# EAGLE design Sensor_Python (EAGLE 9.6.2)
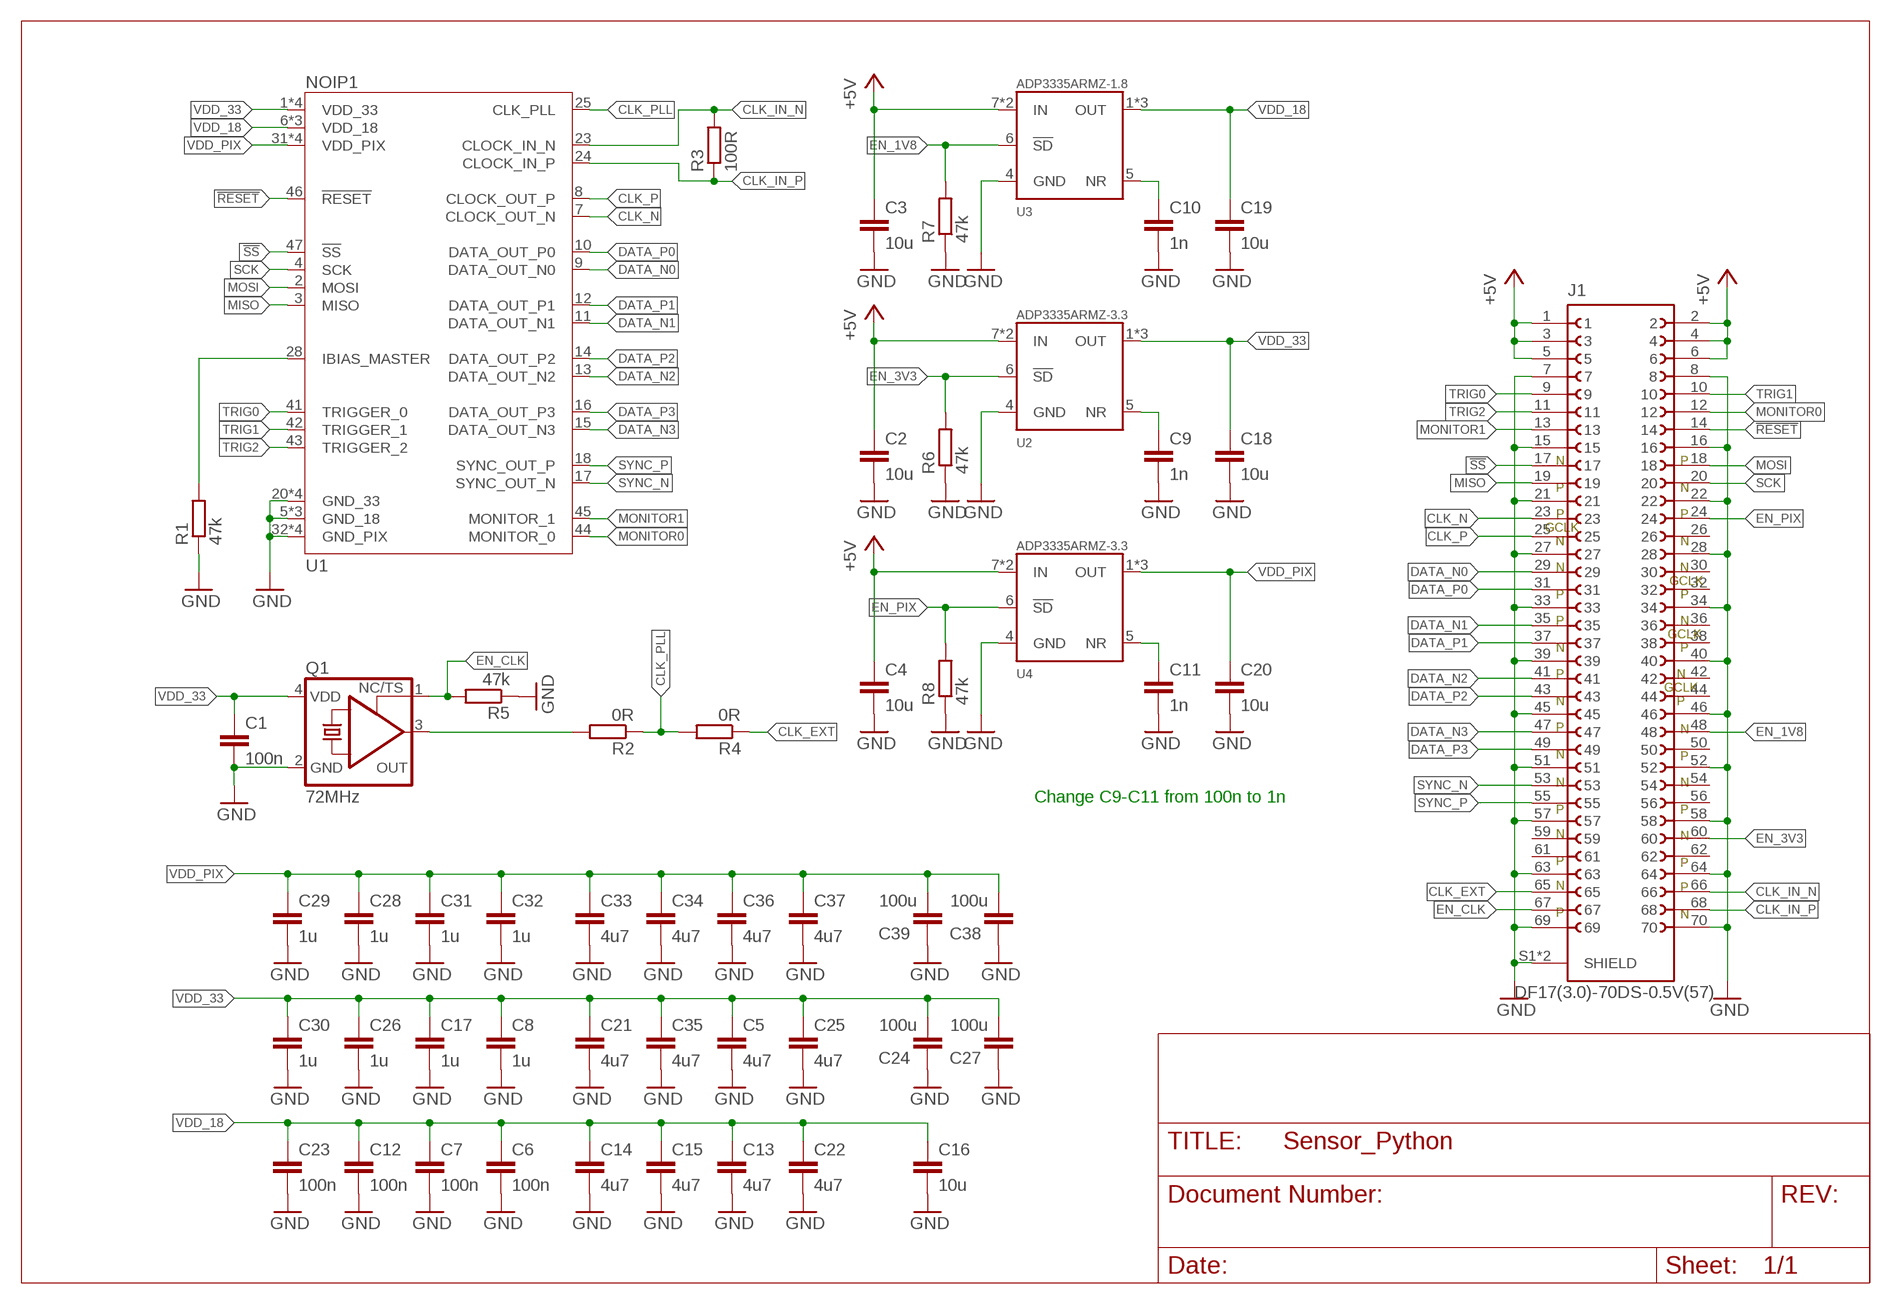
[diagram p0: schematic, sheet 1]

## Parts
C1  100n  C-EUC0402  [C0402]
C2  10u  C-EUC0603  [C0603]
C3  10u  C-EUC0603  [C0603]
C4  10u  C-EUC0603  [C0603]
C5  4u7  C-EUC0603  [C0603]
C6  100n  C-EUC0402  [C0402]
C7  100n  C-EUC0402  [C0402]
C8  1u  C-EUC0402  [C0402]
C9  1n  C-EUC0402  [C0402]
C10  1n  C-EUC0402  [C0402]
C11  1n  C-EUC0402  [C0402]
C12  100n  C-EUC0402  [C0402]
C13  4u7  C-EUC0603  [C0603]
C14  4u7  C-EUC0603  [C0603]
C15  4u7  C-EUC0603  [C0603]
C16  10u  C-EUC0603  [C0603]
C17  1u  C-EUC0402  [C0402]
C18  10u  C-EUC0603  [C0603]
C19  10u  C-EUC0603  [C0603]
C20  10u  C-EUC0603  [C0603]
C21  4u7  C-EUC0603  [C0603]
C22  4u7  C-EUC0603  [C0603]
C23  100n  C-EUC0402  [C0402]
C24  100u  C-EUC1206  [C1206]
C25  4u7  C-EUC0603  [C0603]
C26  1u  C-EUC0402  [C0402]
C27  100u  C-EUC1206  [C1206]
C28  1u  C-EUC0402  [C0402]
C29  1u  C-EUC0402  [C0402]
C30  1u  C-EUC0402  [C0402]
C31  1u  C-EUC0402  [C0402]
C32  1u  C-EUC0402  [C0402]
C33  4u7  C-EUC0603  [C0603]
C34  4u7  C-EUC0603  [C0603]
C35  4u7  C-EUC0603  [C0603]
C36  4u7  C-EUC0603  [C0603]
C37  4u7  C-EUC0603  [C0603]
C38  100u  C-EUC1206  [C1206]
C39  100u  C-EUC1206  [C1206]
J1  DF17(3.0)-70DS-0.5V(57)  [DF17(3.0)-70DS-0.5V(57)]
Q1  72MHz  KXO-PXO/XO-V96  [3.2X2.5_KXO-V96]
R1  47k  R-EU_R0402  [R0402]
R2  0R  R-EU_R0402  [R0402]
R3  100R  R-EU_R0402  [R0402]
R4  0R  R-EU_R0402  [R0402]
R5  47k  R-EU_R0402  [R0402]
R6  47k  R-EU_R0402  [R0402]
R7  47k  R-EU_R0402  [R0402]
R8  47k  R-EU_R0402  [R0402]
U1  NOIP1  [LCC-44]
U2  ADP3335ARMZ-3.3  ADP3335ARMZ  [MSOP08]
U3  ADP3335ARMZ-1.8  ADP3335ARMZ  [MSOP08]
U4  ADP3335ARMZ-3.3  ADP3335ARMZ  [MSOP08]

## Nets
!RESET: J1.14 U1.46(!RESET)
!SS: J1.17 U1.47(!SS)
+5V: C2.1 C3.1 C4.1 J1.1 J1.2 J1.3 J1.4 J1.5 J1.6 U2.7(IN) U2.8(IN) U3.7(IN) U3.8(IN) U4.7(IN) U4.8(IN)
CLK: Q1.3(OUT) R2.2
CLK_EXT: J1.65 R4.1
CLK_IN_N: J1.66 R3.2 U1.23(CLOCK_IN_N)
CLK_IN_P: J1.68 R3.1 U1.24(CLOCK_IN_P)
CLK_N: J1.23 U1.7(CLOCK_OUT_N)
CLK_P: J1.25 U1.8(CLOCK_OUT_P)
CLK_PLL: R2.1 R4.2 U1.25(CLK_PLL)
DATA_N0: J1.29 U1.9(DATA_OUT_N0)
DATA_N1: J1.35 U1.11(DATA_OUT_N1)
DATA_N2: J1.41 U1.13(DATA_OUT_N2)
DATA_N3: J1.47 U1.15(DATA_OUT_N3)
DATA_P0: J1.31 U1.10(DATA_OUT_P0)
DATA_P1: J1.37 U1.12(DATA_OUT_P1)
DATA_P2: J1.43 U1.14(DATA_OUT_P2)
DATA_P3: J1.49 U1.16(DATA_OUT_P3)
EN_1V8: J1.48 R7.2 U3.6(!SD)
EN_3V3: J1.60 R6.2 U2.6(!SD)
EN_CLK: J1.67 Q1.1(TS) R5.2
EN_PIX: J1.24 R8.2 U4.6(!SD)
GND: C1.2 C2.2 C3.2 C4.2 C5.2 C6.2 C7.2 C8.2 C9.2 C10.2 C11.2 C12.2 C13.2 C14.2 C15.2 C16.2 C17.2 C18.2 C19.2 C20.2 C21.2 C22.2 C23.2 C24.2 C25.2 C26.2 C27.2 C28.2 C29.2 C30.2 C31.2 C32.2 C33.2 C34.2 C35.2 C36.2 C37.2 C38.2 C39.2 J1.7 J1.8 J1.15 J1.16 J1.21 J1.22 J1.27 J1.28 J1.33 J1.34 J1.39 J1.40 J1.45 J1.46 J1.51 J1.52 J1.57 J1.58 J1.63 J1.64 J1.69 J1.70 J1.S1(SHIELD) J1.S2(SHIELD) Q1.2(GND) R1.1 R5.1 R6.1 R7.1 R8.1 U1.5(GND_18) U1.20(GND_33) U1.21(GND_18) U1.27(GND_18) U1.30(GND_33) U1.32(GND_PIX) U1.34(GND_PIX) U1.35(GND_33) U1.37(GND_PIX) U1.39(GND_PIX) U1.48(GND_33) U2.4(GND) U3.4(GND) U4.4(GND)
MISO: J1.19 U1.3(MISO)
MONITOR0: J1.12 U1.44(MONITOR_0)
MONITOR1: J1.13 U1.45(MONITOR_1)
MOSI: J1.18 U1.2(MOSI)
N$00001: R1.2 U1.28(IBIAS_MASTER)
N$00002: C11.1 U4.5(NR)
N$00003: C10.1 U3.5(NR)
N$00004: C9.1 U2.5(NR)
SCK: J1.20 U1.4(SCK)
SYNC_N: J1.53 U1.17(SYNC_OUT_N)
SYNC_P: J1.55 U1.18(SYNC_OUT_P)
TRIG0: J1.9 U1.41(TRIGGER_0)
TRIG1: J1.10 U1.42(TRIGGER_1)
TRIG2: J1.11 U1.43(TRIGGER_2)
VDD_18: C6.1 C7.1 C12.1 C13.1 C14.1 C15.1 C16.1 C19.1 C22.1 C23.1 U1.6(VDD_18) U1.22(VDD_18) U1.26(VDD_18) U3.1(OUT) U3.2(OUT) U3.3(OUT)
VDD_33: C1.1 C5.1 C8.1 C17.1 C18.1 C21.1 C24.1 C25.1 C26.1 C27.1 C30.1 C35.1 Q1.4(VDD) U1.1(VDD_33) U1.19(VDD_33) U1.29(VDD_33) U1.36(VDD_33) U2.1(OUT) U2.2(OUT) U2.3(OUT)
VDD_PIX: C20.1 C28.1 C29.1 C31.1 C32.1 C33.1 C34.1 C36.1 C37.1 C38.1 C39.1 U1.31(VDD_PIX) U1.33(VDD_PIX) U1.38(VDD_PIX) U1.40(VDD_PIX) U4.1(OUT) U4.2(OUT) U4.3(OUT)
Unconnected: J1.26 J1.30 J1.32 J1.36 J1.38 J1.42 J1.44 J1.50 J1.54 J1.56 J1.59 J1.61 J1.62

## Notes on the sheet
- N
   
  P
- P
   
  N
- P
   GCLK
  N
- P
   
  N
- N
   
  P
- N
   GCLK
  P
- P
   
  N
- N
  GCLK
  P
- P
  
  N
- N
  GCLK
  P
- P
   
  N
- N
   
  P
- N
   
  P
- N
   
  P
- Change C9-C11 from 100n to 1n
- N
   
  P
- N
   
  P
- N
   
  P
- P
   
  N

## Library data of the parts
C1 = rcl:C-EU: CAPACITOR, European symbol; LCSC: C1525
C2-C4 C8 C16-C20 C26 C28-C32 = rcl:C-EU: CAPACITOR, European symbol; SPICEPREFIX: C
C5 C13-C15 C21 C22 C25 C33-C37 = rcl:C-EU: CAPACITOR, European symbol; LCSC: C19666; SPICEPREFIX: C
C6 C7 C9-C12 C23 = rcl:C-EU: CAPACITOR, European symbol; LCSC: C1525; SPICEPREFIX: C
C24 C27 C38 C39 = rcl:C-EU: CAPACITOR, European symbol; DIGIKEY: 490-GRM31CD80J107MEA8LCT-ND; LCSC: C15008; SPICEPREFIX: C
J1 = Hirose:DF17(3.0)-70DS-0.5V(57)
Q1 = crystal-geyer_V1_0:KXO-PXO/XO-V: Clock Oscillator (PXO/XO) MHz : KXO-V - Serie Model Size l/w/h [mm] Frequency Range Frequency Stability Temp. Range [°C] Output AECQ 200 availabel Datasheet KXO-V94 KXO-V94 KXO-V95 KXO-V95 KXO-V96 KXO-V96 KXO-V99 KXO-V99 KXO-97 KXO-V97 KXO-97 - KXO-V97 2.0/1.6/0.80 2.0/1.6/0.80 2.5/2.0/0.82 2.5/2.0/0.82 3.2/2.5/1.2 3.2/2.5/1.2 5.0/3.2/1.2 5.0/3.2/1.2 7.0/5.08/1.3 7.0/5.08/1.3 7.0/5.08/1.3 32,768 kHz 1,0 ~ 80,0 MHz 32,768 kHz 1,0 ~ 70,0 MHz 32,768 kHz 1,0 ~ 156,0 MHz 32,768 kHz 1,0 ~ 200,0 MHz 32,768 kHz 32,768 kHz 1,0 ~ 160,0 MHz ±25 … ±100ppm ±25 … ±100ppm ±25 … ±100ppm ±25 … ±100ppm ±25 … ±100ppm ±25 … ±100ppm ±25 … ±100ppm ±25 … ±100ppm ±25 … ±100ppm ±25 … ±100ppm ±25 … ±100ppm (*) -40°C …+85°C (*) -40°C …+85°C (*) -40°C …+85°C (*) -40°C …+85°C (*) -40°C …+85°C (*) -40°C …+85°C (*) -40°C …+85°C (*) -40°C …+85°C (*) -40°C …+85°C (*) -40°C …+85°C (*) -40°C …+85°C HCMOS HCMOS HCMOS HCMOS HCMOS HCMOS HCMOS HCMOS HCMOS HCMOS HCMOS - - yes yes yes yes - - - - - KXO-V94-kHz.pdf <http://www.geyer-electronic.de/uploads/tx_userartikelfrequenz/GEYER-KXO-V94-kHz.pdf> KXO-V94.pdf <http://www.geyer-electronic.de/uploads/tx_userartikelfrequenz/GEYER-KXO-V94.pdf> KXO-V95-kHz.pdf <http://www.geyer-electronic.de/uploads/tx_userartikelfrequenz/GEYER-KXO-V95-kHz.pdf> KXO-V95.pdf <http://www.geyer-electronic.de/uploads/tx_userartikelfrequenz/GEYER-KXO-V95.pdf> KXO-V96-kHz.pdf <http://www.geyer-electronic.de/uploads/tx_userartikelfrequenz/GEYER-KXO-V96-kHz.pdf> KXO-V96.pdf <http://www.geyer-electronic.de/uploads/tx_userartikelfrequenz/GEYER-KXO-V96.pdf> KXO-V99-kHz.pdf <http://www.geyer-electronic.de/uploads/tx_userartikelfrequenz/GEYER-KXO-V99-kHz.pdf> KXO-V99.pdf <http://www.geyer-electronic.de/uploads/tx_userartikelfrequenz/GEYER-KXO-V99.pdf> KXO-97-kHz.pdf <http://www.geyer-electronic.de/uploads/tx_userartikelfrequenz/GEYER-KXO-97-kHz.pdf> KXO-V97-kHz.pdf <http://www.geyer-electronic.de/uploads/tx_userartikelfrequenz/GEYER-KXO-V97-kHz.pdf> KXO-V97.pdf <http://www.geyer-electronic.de/uploads/tx_userartikelfrequenz/GEYER-KXO-V97.pdf> <http://www.geyer-electronic.de/fileadmin/template/img/logo-geyer-electronic.png> Details see: http://www.geyer-electronic.de/Frequenz-Produkte.9.0.html Created 2016-06-07, Hans Locher 2016 (C) Geyer Quartz Technology Hans Locher KXOV94,KXOV95;KXOV96;KXOV97;KXO97;2016;2520;3225;5032;70508;2,5x2,0;3,2x2,5;5,0x3,2;7,0x5,08;2.5x2.0;3.2x2.5;5.0x3.2;7.0x5.08;; DIGIKEY: 1473-SIT8208AC-23-33E-72.000000-ND
R1-R8 = rcl:R-EU_: RESISTOR, European symbol; SPICEPREFIX: R
U1 = onsemi:NOIP1: PYTHON 300 / 500 / 1300 1.3/0.5/0.3 MegaPixels Global Shutter CMOS Image Sensors NOIP1SN/SE/FN
U2 U4 = analog_devices:ADP3335: ADP3335 High Accuracy, Ultralow I Q , 500 mA, anyCAP Low Dropout Regulator; DIGIKEY: 505-ADP3335ARMZ-3.3RL7CT-ND
U3 = analog_devices:ADP3335: ADP3335 High Accuracy, Ultralow I Q , 500 mA, anyCAP Low Dropout Regulator; DIGIKEY: 505-ADP3335ARMZ-1.8-R7CT-ND

## Board
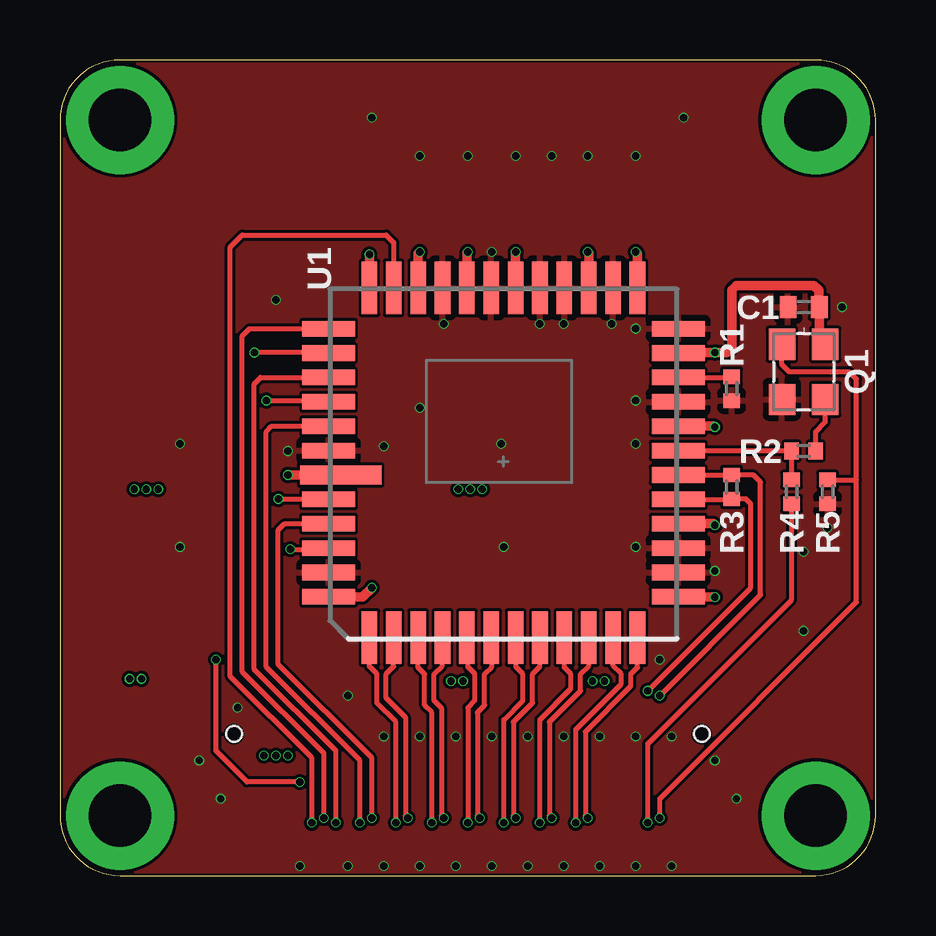
[diagram p1: board, top side]
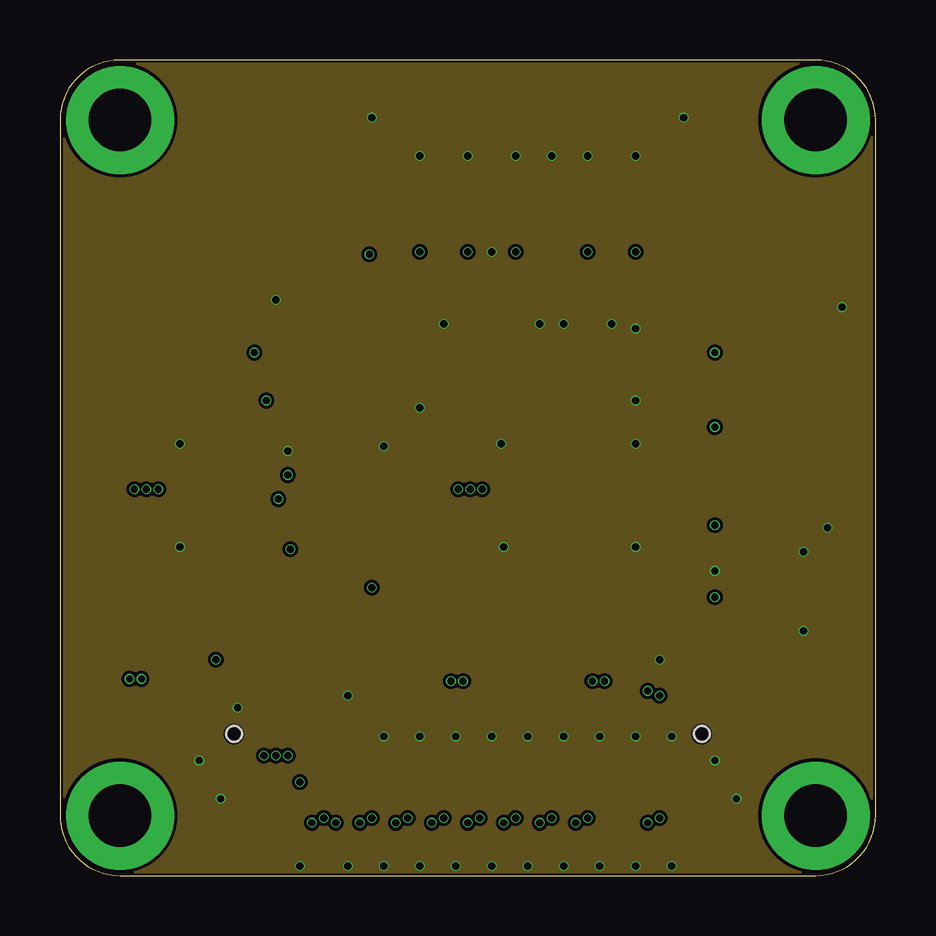
[diagram p2: board, inner layer Route2]
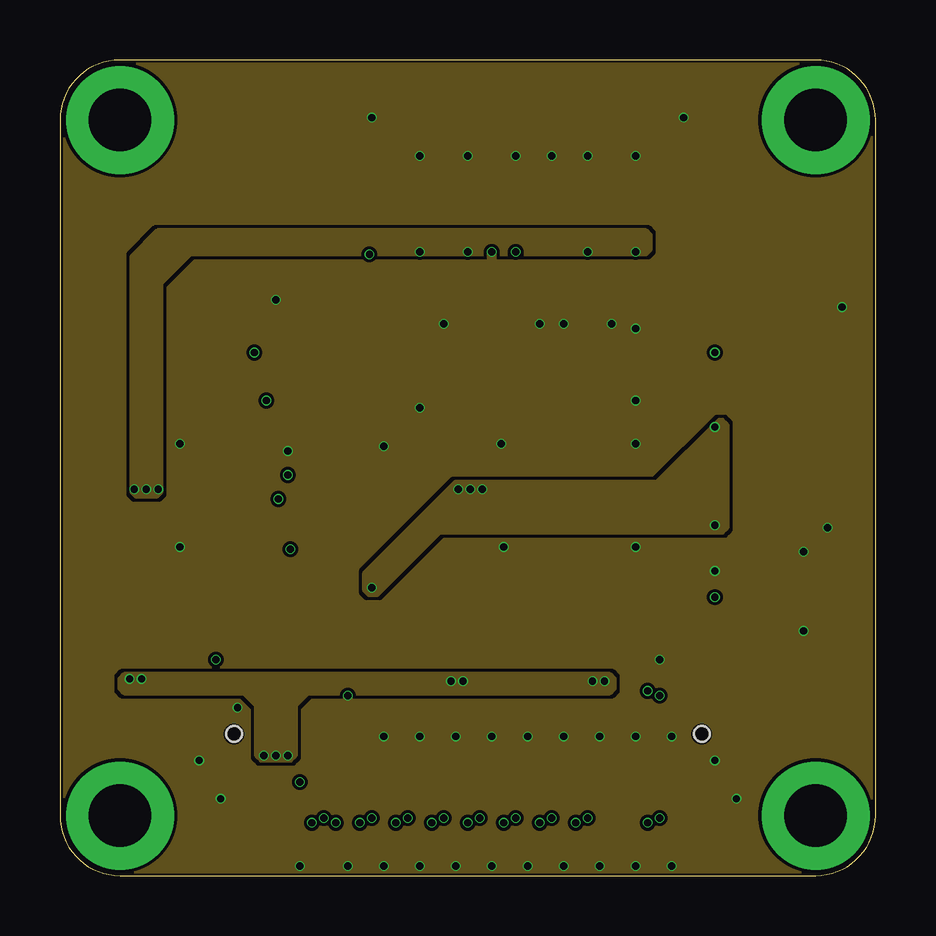
[diagram p3: board, inner layer Route15]
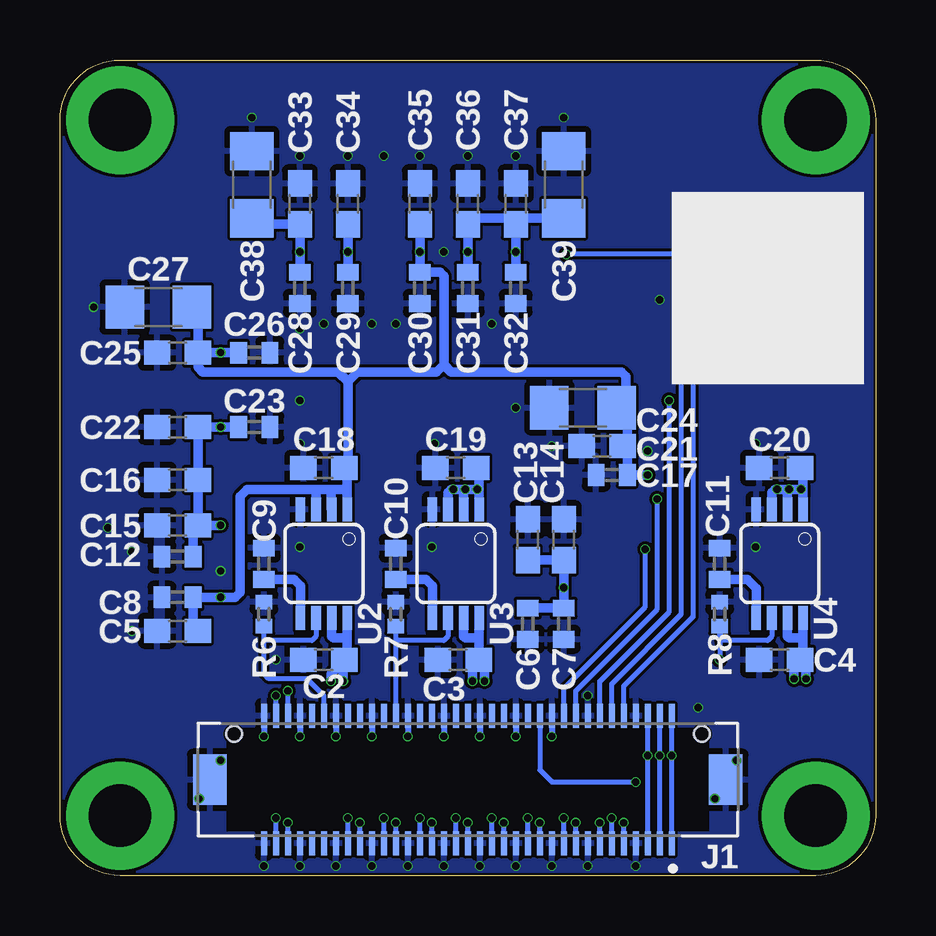
[diagram p4: board, bottom side, seen from below]

Size 34 x 34 mm. Coordinates in mm from the lower left corner, seen from the top.
Outline: 0,31.5 0,2.5 arc90 2.5,0 31.5,0 arc90 34,2.5 34,31.5 arc90 31.5,34 2.5,34 arc90 0,31.5
Copper layers (1*2*15*16): Top 0.035559375mm / dielectric 0.17018125mm / Route2 0.01778125mm / dielectric 47mil / Route15 0.01778125mm / dielectric 0.17018125mm / Bottom 0.035559375mm
Design rules "jlcpcb-4-layer *": minimum track width 5mil, minimum drill 0.2mm, track to track 5mil, track to pad 5mil, pad to pad 5mil, via to via 5mil, smd to smd 0mil, copper to edge 0.1mm, drill to drill 5mil, minimum pad ring 0.1mm, minimum via ring 0.05mm, stop-mask expansion 3mil, vias tented up to drill 100mil, thermal gap 10mil

### Footprints (pad centres in the part's own frame; a part is rotated, then mirrored left to right if it is on the bottom)
C0402 = smd 0.7 x 0.9: 1 -0.65,0; 2 0.65,0
C0603 = smd 1.1 x 1: 1 -0.85,0; 2 0.85,0
C1206 = smd 1.6 x 1.8: 1 -1.4,0; 2 1.4,0
DF17(3.0)-70DS-0.5V(57) = smd 0.25 x 1: 1 -8.5,2.65; 2 -8.5,-2.65; 3 -8,2.65; 4 -8,-2.65; 5 -7.5,2.65; 6 -7.5,-2.65; 7 -7,2.65; 8 -7,-2.65; 9 -6.5,2.65; 10 -6.5,-2.65; 11 -6,2.65; 12 -6,-2.65; 13 -5.5,2.65; 14 -5.5,-2.65; 15 -5,2.65; 16 -5,-2.65; 17 -4.5,2.65; 18 -4.5,-2.65; 19 -4,2.65; 20 -4,-2.65; 21 -3.5,2.65; 22 -3.5,-2.65; 23 -3,2.65; 24 -3,-2.65; 25 -2.5,2.65; 26 -2.5,-2.65; 27 -2,2.65; 28 -2,-2.65; 29 -1.5,2.65; 30 -1.5,-2.65; 31 -1,2.65; 32 -1,-2.65; 33 -0.5,2.65; 34 -0.5,-2.65; 35 0,2.65; 36 0,-2.65; 37 0.5,2.65; 38 0.5,-2.65; 39 1,2.65; 40 1,-2.65; 41 1.5,2.65; 42 1.5,-2.65; 43 2,2.65; 44 2,-2.65; 45 2.5,2.65; 46 2.5,-2.65; 47 3,2.65; 48 3,-2.65; 49 3.5,2.65; 50 3.5,-2.65; 51 4,2.65; 52 4,-2.65; 53 4.5,2.65; 54 4.5,-2.65; 55 5,2.65; 56 5,-2.65; 57 5.5,2.65; 58 5.5,-2.65; 59 6,2.65; 60 6,-2.65; 61 6.5,2.65; 62 6.5,-2.65; 63 7,2.65; 64 7,-2.65; 65 7.5,2.65; 66 7.5,-2.65; 67 8,2.65; 68 8,-2.65; 69 8.5,2.65; 70 8.5,-2.65 | smd 1.4 x 2.1: S1 -10.75,0; S2 10.75,0 | hole 0.65: -9.75,-1.9; 9.75,-1.9
3.2X2.5_KXO-V96 = smd 1.3 x 1.1: 1 -1.15,-0.9; 2 1.15,-0.9; 3 1.15,0.9; 4 -1.15,0.9
R0402 = smd 0.6 x 0.7: 1 -0.5,0; 2 0.5,0
LCC-44 = smd 3.4 x 0.8: 1 -6.596,-2.1 | smd 2.2 x 0.65: 2 -7.104,-3.116; 3 -7.104,-4.132; 4 -7.104,-5.148; 5 -7.104,-6.164; 6 -7.104,-7.18; 19 7.476,-7.18; 20 7.476,-6.164; 21 7.476,-5.148; 22 7.476,-4.132; 23 7.476,-3.116; 24 7.476,-2.1; 25 7.476,-1.084; 26 7.476,-0.068; 27 7.476,0.948; 28 7.476,1.964; 29 7.476,2.98; 30 7.476,3.996; 43 -7.104,3.996; 44 -7.104,2.98; 45 -7.104,1.964; 46 -7.104,0.948; 47 -7.104,-0.068; 48 -7.104,-1.084 | smd 0.65 x 2.2: 7 -5.402,-8.882; 8 -4.386,-8.882; 9 -3.37,-8.882; 10 -2.354,-8.882; 11 -1.338,-8.882; 12 -0.322,-8.882; 13 0.694,-8.882; 14 1.71,-8.882; 15 2.726,-8.882; 16 3.742,-8.882; 17 4.758,-8.882; 18 5.774,-8.882; 31 5.774,5.698; 32 4.758,5.698; 33 3.742,5.698; 34 2.726,5.698; 35 1.71,5.698; 36 0.694,5.698; 37 -0.322,5.698; 38 -1.338,5.698; 39 -2.354,5.698; 40 -3.37,5.698; 41 -4.386,5.698; 42 -5.402,5.698
MSOP08 = smd 0.4 x 1: 1 -0.976,-2.263; 2 -0.326,-2.263; 3 0.324,-2.263; 4 0.974,-2.263; 5 0.974,2.262; 6 0.324,2.262; 7 -0.326,2.262; 8 -0.976,2.262

### Placement (x,y rotation side)
C1  31,23.7 180 top
C2  23,9 180 bottom
C3  17.4,9 180 bottom
C4  4,9 180 bottom
C5  29.1,10.2 180 bottom
C6  14.5,10.5 270 bottom
C7  13,10.5 270 bottom
C8  29.1,11.6 180 bottom
C9  25.5,13 90 bottom
C10  20,13 90 bottom
C11  6.5,13 90 bottom
C12  29.1,13.3 180 bottom
C13  14.5,14 90 bottom
C14  13,14 90 bottom
C15  29.1,14.6 180 bottom
C16  29.1,16.5 180 bottom
C17  11,16.7 180 bottom
C18  23,17 180 bottom
C19  17.5,17 180 bottom
C20  4,17 180 bottom
C21  11.4,17.9 180 bottom
C22  29.1,18.7 180 bottom
C23  25.9,18.7 0 bottom
C24  12.2,19.5 180 bottom
C25  29.1,21.8 180 bottom
C26  25.9,21.8 0 bottom
C27  29.9,23.7 180 bottom
C28  24,24.5 270 bottom
C29  22,24.5 270 bottom
C30  19,24.5 270 bottom
C31  17,24.5 270 bottom
C32  15,24.5 270 bottom
C33  24,28 90 bottom
C34  22,28 90 bottom
C35  19,28 90 bottom
C36  17,28 90 bottom
C37  15,28 90 bottom
C38  26,28.8 90 bottom
C39  13,28.8 90 bottom
J1  17,4 180 bottom
Q1  31,21 270 top
R1  28,20.3 90 top
R2  31,17.7 0 top
R3  28,16.2 270 top
R4  30.5,16 90 top
R5  32,16 90 top
R6  25.5,10.9 270 bottom
R7  20,10.9 270 bottom
R8  6.5,10.9 270 bottom
U1  18.3,18.8 0 top
U2  23,13 180 bottom
U3  17.5,13 180 bottom
U4  4,13 180 bottom

### Tracks (layer width: path | path; a pad name or v marks a point on that pad's centre or on a via)
!RESET  (via drill 0.3)
  Top 0.2: v8.6,19.8 11.14,19.8 U1.46
  Bottom 0.2: J1.14 11.5,8.1 8.6,11 v8.6,19.8
!SS  (via drill 0.3)
  Top 0.2: v12.5,2.2 12.5,4.8 8.6,8.7 8.6,18.5 8.83,18.73 U1.47
  Bottom 0.2: J1.17 v12.5,2.2
+5V  (via drill 0.3)
  Bottom 0.2: J1.1 v8.5,5 J1.2 | J1.3 v9,5 J1.4 | J1.5 v9.5,5 J1.6
  Bottom 0.4: U4.8 3.02,9.9 | 3.02,9.9 3.02,9.13 C4.1 | U4.7 3.67,9.97 3.6,9.9 3.02,9.9 | U3.8 16.52,9.9 | 16.52,9.9 16.52,9.03 | 16.52,9.03 C3.1 16.8,8.75 v16.8,8.1 | U3.7 17.17,9.97 17.1,9.9 16.52,9.9 | U2.8 22.02,9.9 | 22.02,9.9 22.02,9.13 C2.1 22.2,8.95 22.2,8.9 | U2.7 22.67,9.97 22.6,9.9 22.02,9.9 | C4.1 2.9,8.75 v2.9,8.2 | v3.4,8.2 3.4,8.75 C4.1 | v16.3,8.1 16.3,8.8 16.52,9.03 | v22.2,8.1 22.2,8.9 | v22.7,8.1 22.7,8.4 22.2,8.9
  pour Route15: 7.7,7.6 2.7,7.6 2.5,7.8 2.5,8.2 2.7,8.4 22.9,8.4 23.1,8.2 23.1,7.8 22.9,7.6 10.3,7.6 9.8,7.1 9.8,5 9.6,4.8 8.4,4.8 8.2,5 8.2,7.1
CLK
  Top 0.2: R2.2 31.5,18.5 31.9,18.9 Q1.3
CLK_EXT  (via drill 0.3)
  Top 0.2: v24.5,2.2 24.5,5.5 30.5,11.5 R4.1
  Bottom 0.2: J1.65 v24.5,2.2
CLK_IN_N  (via drill 0.3)
  Top 0.2: U1.23 28,15.68 R3.2 28.6,15.7 28.8,15.5 28.8,12 v24.5,7.7
  Bottom 0.2: J1.66 v24.5,7.7
CLK_IN_P  (via drill 0.3)
  Top 0.2: U1.24 R3.1 28.9,16.7 29.2,16.4 29.2,11.7 v25,7.5
  Bottom 0.2: J1.68 v25,7.5
CLK_N  (via drill 0.3)
  Top 0.2: v14,2.2 14,6.4 13.2,7.2 13.2,8.42 12.9,8.72 U1.7
  Bottom 0.2: J1.23 v14,2.2
CLK_P  (via drill 0.3)
  Top 0.2: v14.5,2.4 14.4,2.5 14.4,6.6 13.6,7.4 13.6,8.4 13.91,8.71 U1.8
  Bottom 0.2: J1.25 v14.5,2.4
CLK_PLL
  Top 0.2: U1.25 30.48,17.72 R2.1 R4.2
DATA_N0  (via drill 0.3)
  Top 0.2: v15.5,2.2 15.5,6.8 15.2,7.1 15.2,8.4 14.93,8.67 U1.9
  Bottom 0.2: J1.29 v15.5,2.2
DATA_N1  (via drill 0.3)
  Top 0.2: v17,2.2 17,7 17.3,7.3 17.3,8.4 17,8.7 17,9.88 U1.11
  Bottom 0.2: J1.35 v17,2.2
DATA_N2  (via drill 0.3)
  Top 0.2: v18.5,2.2 18.5,6.5 19.3,7.3 19.3,8.4 19,8.7 U1.13
  Bottom 0.2: J1.41 v18.5,2.2
DATA_N3  (via drill 0.3)
  Top 0.2: v20,2.2 20,6.5 21.3,7.8 21.3,8.4 21.03,8.67 U1.15
  Bottom 0.2: J1.47 v20,2.2
DATA_P0  (via drill 0.3)
  Top 0.2: v16,2.4 15.9,2.5 15.9,7 15.6,7.3 15.6,8.4 15.95,8.75 U1.10
  Bottom 0.2: J1.31 v16,2.4
DATA_P1  (via drill 0.3)
  Top 0.2: U1.12 18,9.9 18,8.7 17.7,8.4 17.7,7.1 17.4,6.8 17.4,2.5 v17.5,2.4
  Bottom 0.2: J1.37 v17.5,2.4
DATA_P2  (via drill 0.3)
  Top 0.2: v19,2.4 18.9,2.5 18.9,6.4 19.7,7.2 19.7,8.4 20.01,8.71 U1.14
  Bottom 0.2: J1.43 v19,2.4
DATA_P3  (via drill 0.3)
  Top 0.2: v20.5,2.4 20.4,2.5 20.4,6.4 21.7,7.7 21.7,8.4 22.04,8.74 U1.16
  Bottom 0.2: J1.49 v20.5,2.4
EN_1V8
  Bottom 0.2: 20,9.8 R7.2 | U3.6 17.82,9.98 18,9.8 20,9.8 | J1.48 20,9.8
EN_3V3
  Bottom 0.2: J1.60 23,7.5 23.7,8.2 25.3,8.2 25.5,8.4 25.5,9.8 | 25.5,9.8 R6.2 | U2.6 23.32,9.98 23.5,9.8 25.5,9.8
EN_CLK  (via drill 0.3)
  Top 0.2: v25,2.4 25,3.2 33.2,11.4 33.2,16.5 | Q1.1 30.1,21.3 30.4,21 32.9,21 33.2,20.7 33.2,16.5 | R5.2 33.2,16.5
  Bottom 0.2: J1.67 v25,2.4
EN_PIX  (via drill 0.3)
  Top 0.2: v10,3.9 7.8,3.9 6.5,5.2 v6.5,9
  Bottom 0.2: U4.6 4.32,9.98 4.5,9.8 6.5,9.8 R8.2 v6.5,9 | J1.24 14,4.4 13.5,3.9 v10,3.9
GND  (via drill 0.3)
  Bottom 0.25: J1.40 v18,5.8 | J1.46 v19.5,5.8 | J1.52 v21,5.8 | J1.58 v22.5,5.8 | J1.34 v16.5,5.8 | J1.64 v24,5.8 | J1.28 v15,5.8 | J1.22 v13.5,5.8 | J1.70 v25.5,5.8
  other vias: 15,0.4 16.5,0.4 18,0.4 19.5,0.4 21,0.4 22.5,0.4 24,0.4 5.8,4.8 6.7,3.2 27.3,4.8 28.2,3.2 13.5,0.4 12,0.4 10,0.4 25.5,0.4 9,24 9.5,17.7 16,23 18,26 20,23 21,23 23,23 24,22.8 24,19.8 24,13.7 27.3,12.7 15,30 17,30 19,30 20.5,30 22,30 24,30 26,31.6 13,31.6 32,14.5 5,18 15,19.5 13.5,17.9 18.4,18 31,10.2 12,7.5 25,9 18.5,13.7 5,13.7 32.6,23.7 31,13.5 24,18 7.4,7
  pour Top: 0,0 34,0 34,34 0,34
  pour Bottom: 0,0 34,0 34,34 0,34
  pour Route15 (rank 2): 0,0 34,0 34,34 0,34
  pour Route2: 0,0 34,0 34,34 0,34
MISO  (via drill 0.3)
  Top 0.2: v13,2.4 13,4.9 9.1,8.8 9.1,14.4 9.37,14.67 U1.3
  Bottom 0.2: J1.19 v13,2.4
MONITOR0  (via drill 0.3)
  Top 0.2: U1.44 11.18,21.8 v8.1,21.8
  Bottom 0.2: J1.12 11,8 8.1,10.9 v8.1,21.8
MONITOR1  (via drill 0.3)
  Top 0.2: v11.5,2.2 11.5,5.2 8.1,8.6 8.1,20.5 8.36,20.76 U1.45
  Bottom 0.2: J1.13 v11.5,2.2
MOSI  (via drill 0.3)
  Top 0.2: v9.1,15.7 11.18,15.7 U1.2
  Bottom 0.2: J1.18 12.5,7.7 9.1,11.1 v9.1,15.7
N$00001
  Top 0.2: U1.28 28,20.76 R1.2
N$00002
  Bottom 0.4: U4.5 4.97,11.97 5.35,12.35 C11.1
N$00003
  Bottom 0.4: U3.5 18.47,12.07 18.75,12.35 C10.1
N$00004
  Bottom 0.4: U2.5 23.97,12.07 24.25,12.35 C9.1
N$00025  (via drill 2.6 pad 4.5)
  other vias: 2.5,31.5
N$00026  (via drill 2.6 pad 4.5)
  other vias: 31.5,31.5
N$00027  (via drill 2.6 pad 4.5)
  other vias: 2.5,2.5
N$00028  (via drill 2.6 pad 4.5)
  other vias: 31.5,2.5
SCK  (via drill 0.3)
  Top 0.2: v9.6,13.6 11.14,13.6 U1.4
  Bottom 0.2: J1.20 13,7.8 9.6,11.2 v9.6,13.6
SYNC_N  (via drill 0.3)
  Top 0.2: v21.5,2.2 21.5,6.1 23.4,8 23.4,8.4 23.06,8.74 U1.17
  Bottom 0.2: J1.53 v21.5,2.2
SYNC_P  (via drill 0.3)
  Top 0.2: v22,2.4 21.9,2.5 21.9,6 23.8,7.9 23.8,8.4 24.07,8.67 U1.18
  Bottom 0.2: J1.55 v22,2.4
TRIG0  (via drill 0.3)
  Top 0.2: v10.5,2.2 10.5,4.9 7.1,8.3 7.1,26.2 7.6,26.7 13.6,26.7 13.91,26.39 U1.41
  Bottom 0.2: J1.9 v10.5,2.2
TRIG1  (via drill 0.3)
  Top 0.2: v12.9,25.9
  Top 0.4: U1.42 v12.9,25.9
  Bottom 0.2: J1.10 10.5,7.9 7.6,10.8 7.6,25.6 7.9,25.9 v12.9,25.9
TRIG2  (via drill 0.3)
  Top 0.2: v11,2.4 11,5.1 7.6,8.5 7.6,22.5 7.9,22.8 U1.43
  Bottom 0.2: J1.11 v11,2.4
VDD_18  (via drill 0.3)
  Top 0.4: U1.26 27.27,18.73 v27.3,18.7 | U1.22 27.23,14.67 v27.3,14.6 | U1.6 12.62,11.62 v13,12
  Bottom 0.4: U3.1 16.52,16.1 | 16.52,16.1 16.52,16.87 C19.1 | U3.3 17.82,15.98 17.7,16.1 v17.6,16.1 17.2,16.1 | 16.52,16.1 v16.6,16.1 v17.1,16.1 17.2,16.1 | C23.1 v27.3,18.7 C22.1 C16.1 C15.1 | v27.3,14.6 C15.1 | C12.1 28.45,14.4 C15.1 | C13.1 C14.1 v13,12 C7.1 C6.1 | U3.2 17.17,16.07 17.2,16.1
  pour Route15: 13.2,11.7 12.9,11.7 12.7,11.9 12.7,12.6 16.5,16.4 24.9,16.4 27.5,19 27.6,19 27.8,18.8 27.8,14.5 27.6,14.3 15.8,14.3
VDD_33  (via drill 0.3)
  Top 0.4: U1.29 25.8,21.8 v27.3,21.8 27.8,21.8 28,22 28,24.4 28.2,24.6 31.43,24.6 31.62,24.4 31.62,23.73 C1.1 31.65,22.4 Q1.4 | U1.36 v18.99,25.99 v19,26 | U1.1 v9.5,16.7 | U1.19 27.28,11.62 v27.3,11.6
  Bottom 0.4: U2.1 22.02,16.1 | 22.02,16.1 22.02,16.87 C18.1 22,17.15 22,20.6 | U2.3 23.32,15.98 23.2,16.1 | 22.02,16.1 22.7,16.1 | 22.7,16.1 23.2,16.1 | U2.2 22.7,15.29 22.7,16.1 | C25.1 28.25,21.2 28.05,21 22.4,21 22,20.6 | C25.1 v27.3,21.8 C26.1 | C25.1 28.25,23.45 C27.1 | v9.5,16.7 C17.1 10.35,17.7 C21.1 10.35,18.1 10.35,19.05 C24.1 10.6,19.5 10.4,19.7 10.4,20.8 10.6,21 17.7,21 18,21.3 | 22,20.6 21.6,21 18.3,21 18,21.3 | 18,21.3 18,25 18.15,25.15 C30.1 v19,26 C35.1 | C5.1 28.45,10.4 C8.1 v27.3,11.6 26.7,11.6 26.5,11.8 26.5,15.8 26.2,16.1 23.2,16.1
VDD_PIX  (via drill 0.3)
  Top 0.4: U1.33 22.04,25.96 v22,26 | U1.31 24.07,25.93 v24,26 | U1.38 16.96,25.96 v17,26 | U1.40 14.93,25.93 v15,26
  Bottom 0.4: U4.1 3.02,16.1 | 3.02,16.1 3.02,16.87 C20.1 | U4.3 4.32,15.98 4.2,16.1 v4.1,16.1 3.7,16.1 | 3.02,16.1 v3.1,16.1 v3.6,16.1 3.7,16.1 | U4.2 3.67,16.07 3.7,16.1 | C39.1 14.75,27.4 C37.1 | C37.1 v15,26 C32.1 | C37.1 15.25,27.4 16.75,27.4 C36.1 v17,26 C31.1 | C34.1 v22,26 C29.1 | C38.1 25.75,27.15 C33.1 v24,26 C28.1
  pour Route15: 4,15.8 3.2,15.8 3,16 3,25.8 4.1,26.9 24.4,26.9 24.6,26.7 24.6,26.1 24.4,25.9 5.4,25.9 4.2,24.7 4.2,16

### Text on the board
tStop: PYTHON